# EasyEDA schematic Schematic.json
TITLE: New Schematic; REV: 1.0; Date: 2018-04-30; Sheet: 1/1; Drawn By: ridvanaltun
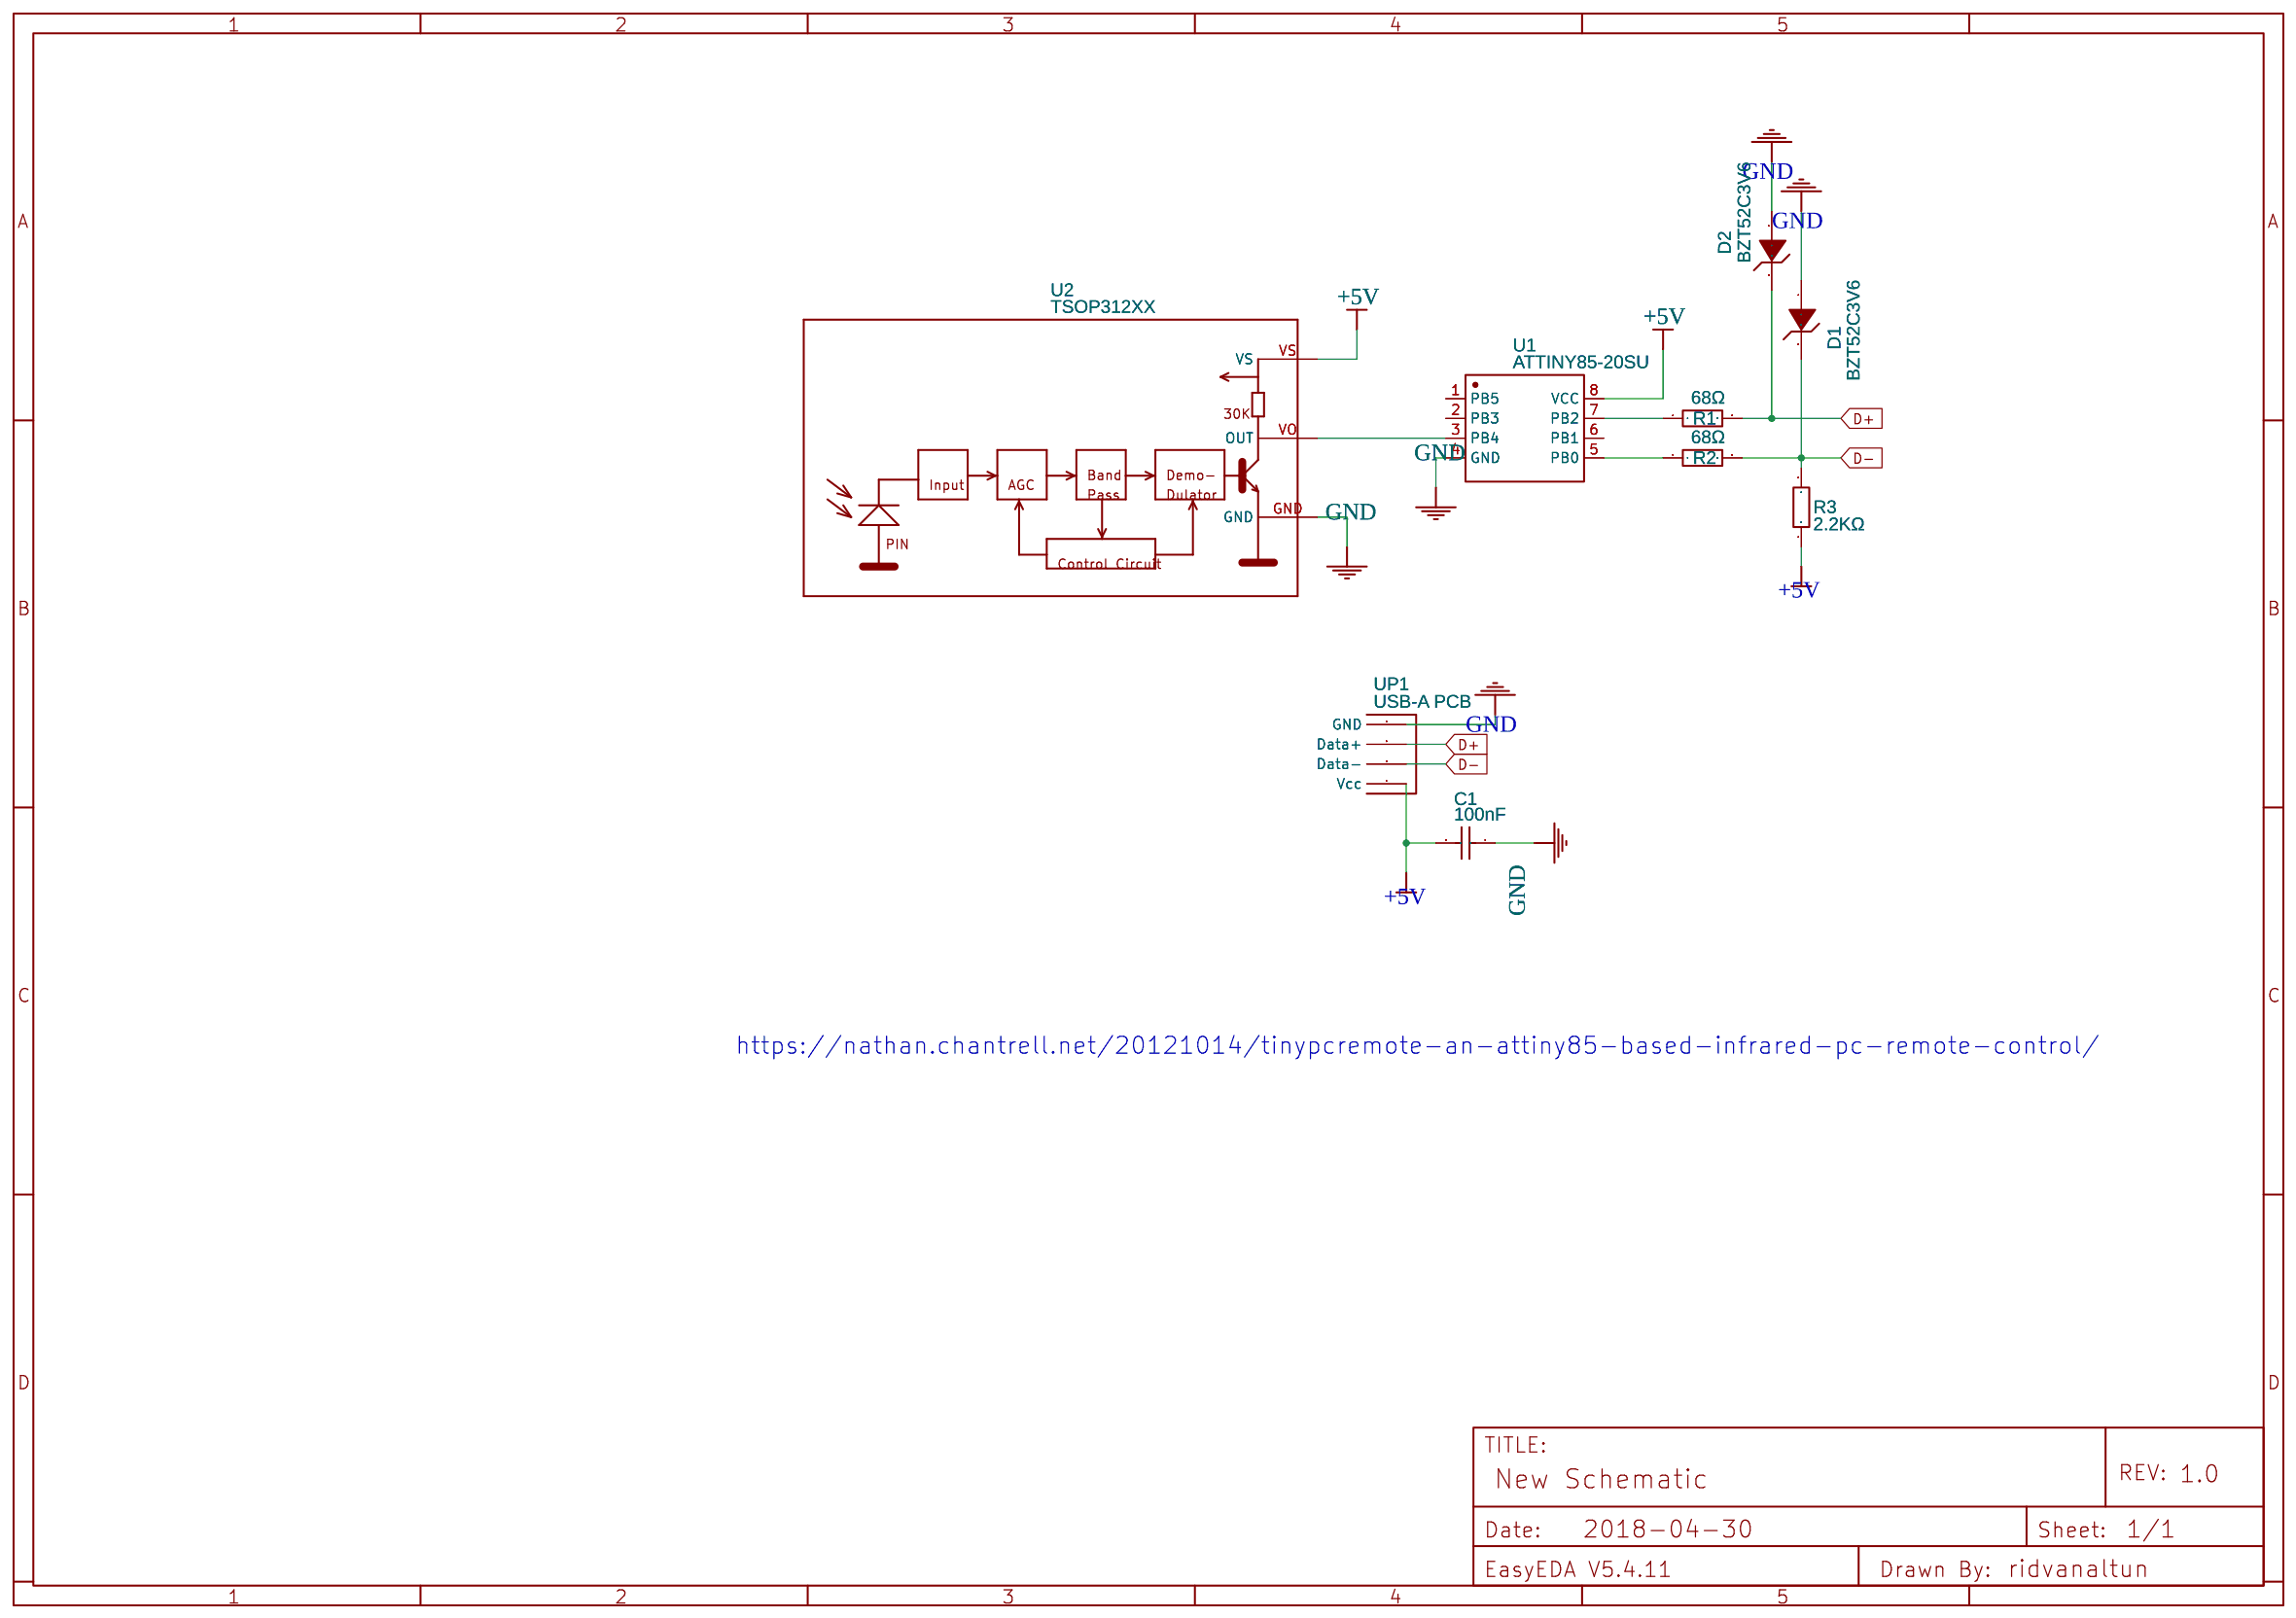
[diagram p0: schematic sheet]

## Parts
C1  100nF  [0603]
D1  BZT52C3V6  [SOD-123]
D2  BZT52C3V6  [SOD-123]
R1  68Ω  [0603]
R2  68Ω  [0603]
R3  2.2KΩ  [0603]
U1  ATTINY85-20SU  [SOIC-8_208MIL]
U2  TSOP312XX  [TSOP312]
UP1  USB-A PCB  [USB-A PCB]

## Library data of the parts
C1 = 0603B104K500NT: Supplier: LCSC; Manufacturer: FH; LCSC: C30926
D1 D2 = -: Supplier: LCSC; LCSC: C2113; Manufacturer: CJ; image: //image.lceda.cn/szlcsc/C2113.jpg
R1 R2 = RTT0368R0FTP: Supplier: LCSC; Manufacturer: RALEC; LCSC: C103788
R3 = CR0603FA2201G: Supplier: LCSC; Manufacturer: LIZ; LCSC: C100864
U1 = -: Supplier: LCSC; Manufacturer: MICROCHIP; LCSC: C89852
U2 = -: Manufacturer Part: ?
UP1 = -: Manufacturer Part: New SchematicLib; Contributor: kozlov.sergey

## Nets
+5V: C1.2 R3.1 U1.8(VCC) U2.VS UP1.4(Vcc)
GND: C1.1 D1.1(A) D2.1(A) U1.4(GND) U2.GND UP1.1(GND)
D+: D2.2(K) R1.2 UP1.2(Data+)
D-: D1.2(K) R2.2 R3.2 UP1.3(Data-)
Net-(R1-1): R1.1 U1.7(PB2)
Net-(R2-1): R2.1 U1.5(PB0)
Net-(U1-3): U1.3(PB4) U2.VO(OUT)

Not connected (* = marked no-connect by the designer): U1 1(PB5) 2(PB3) 6(PB1)

## Notes on the sheet
- https://nathan.chantrell.net/20121014/tinypcremote-an-attiny85-based-infrared-pc-remote-control/
